# EasyEDA schematic abacusprojecteasyedav1.0.json
TITLE: First abacus prototype; REV: 1.0; Date: 2019-10-15; Sheet: 1/1; Drawn By: andissace; Company: abacus project
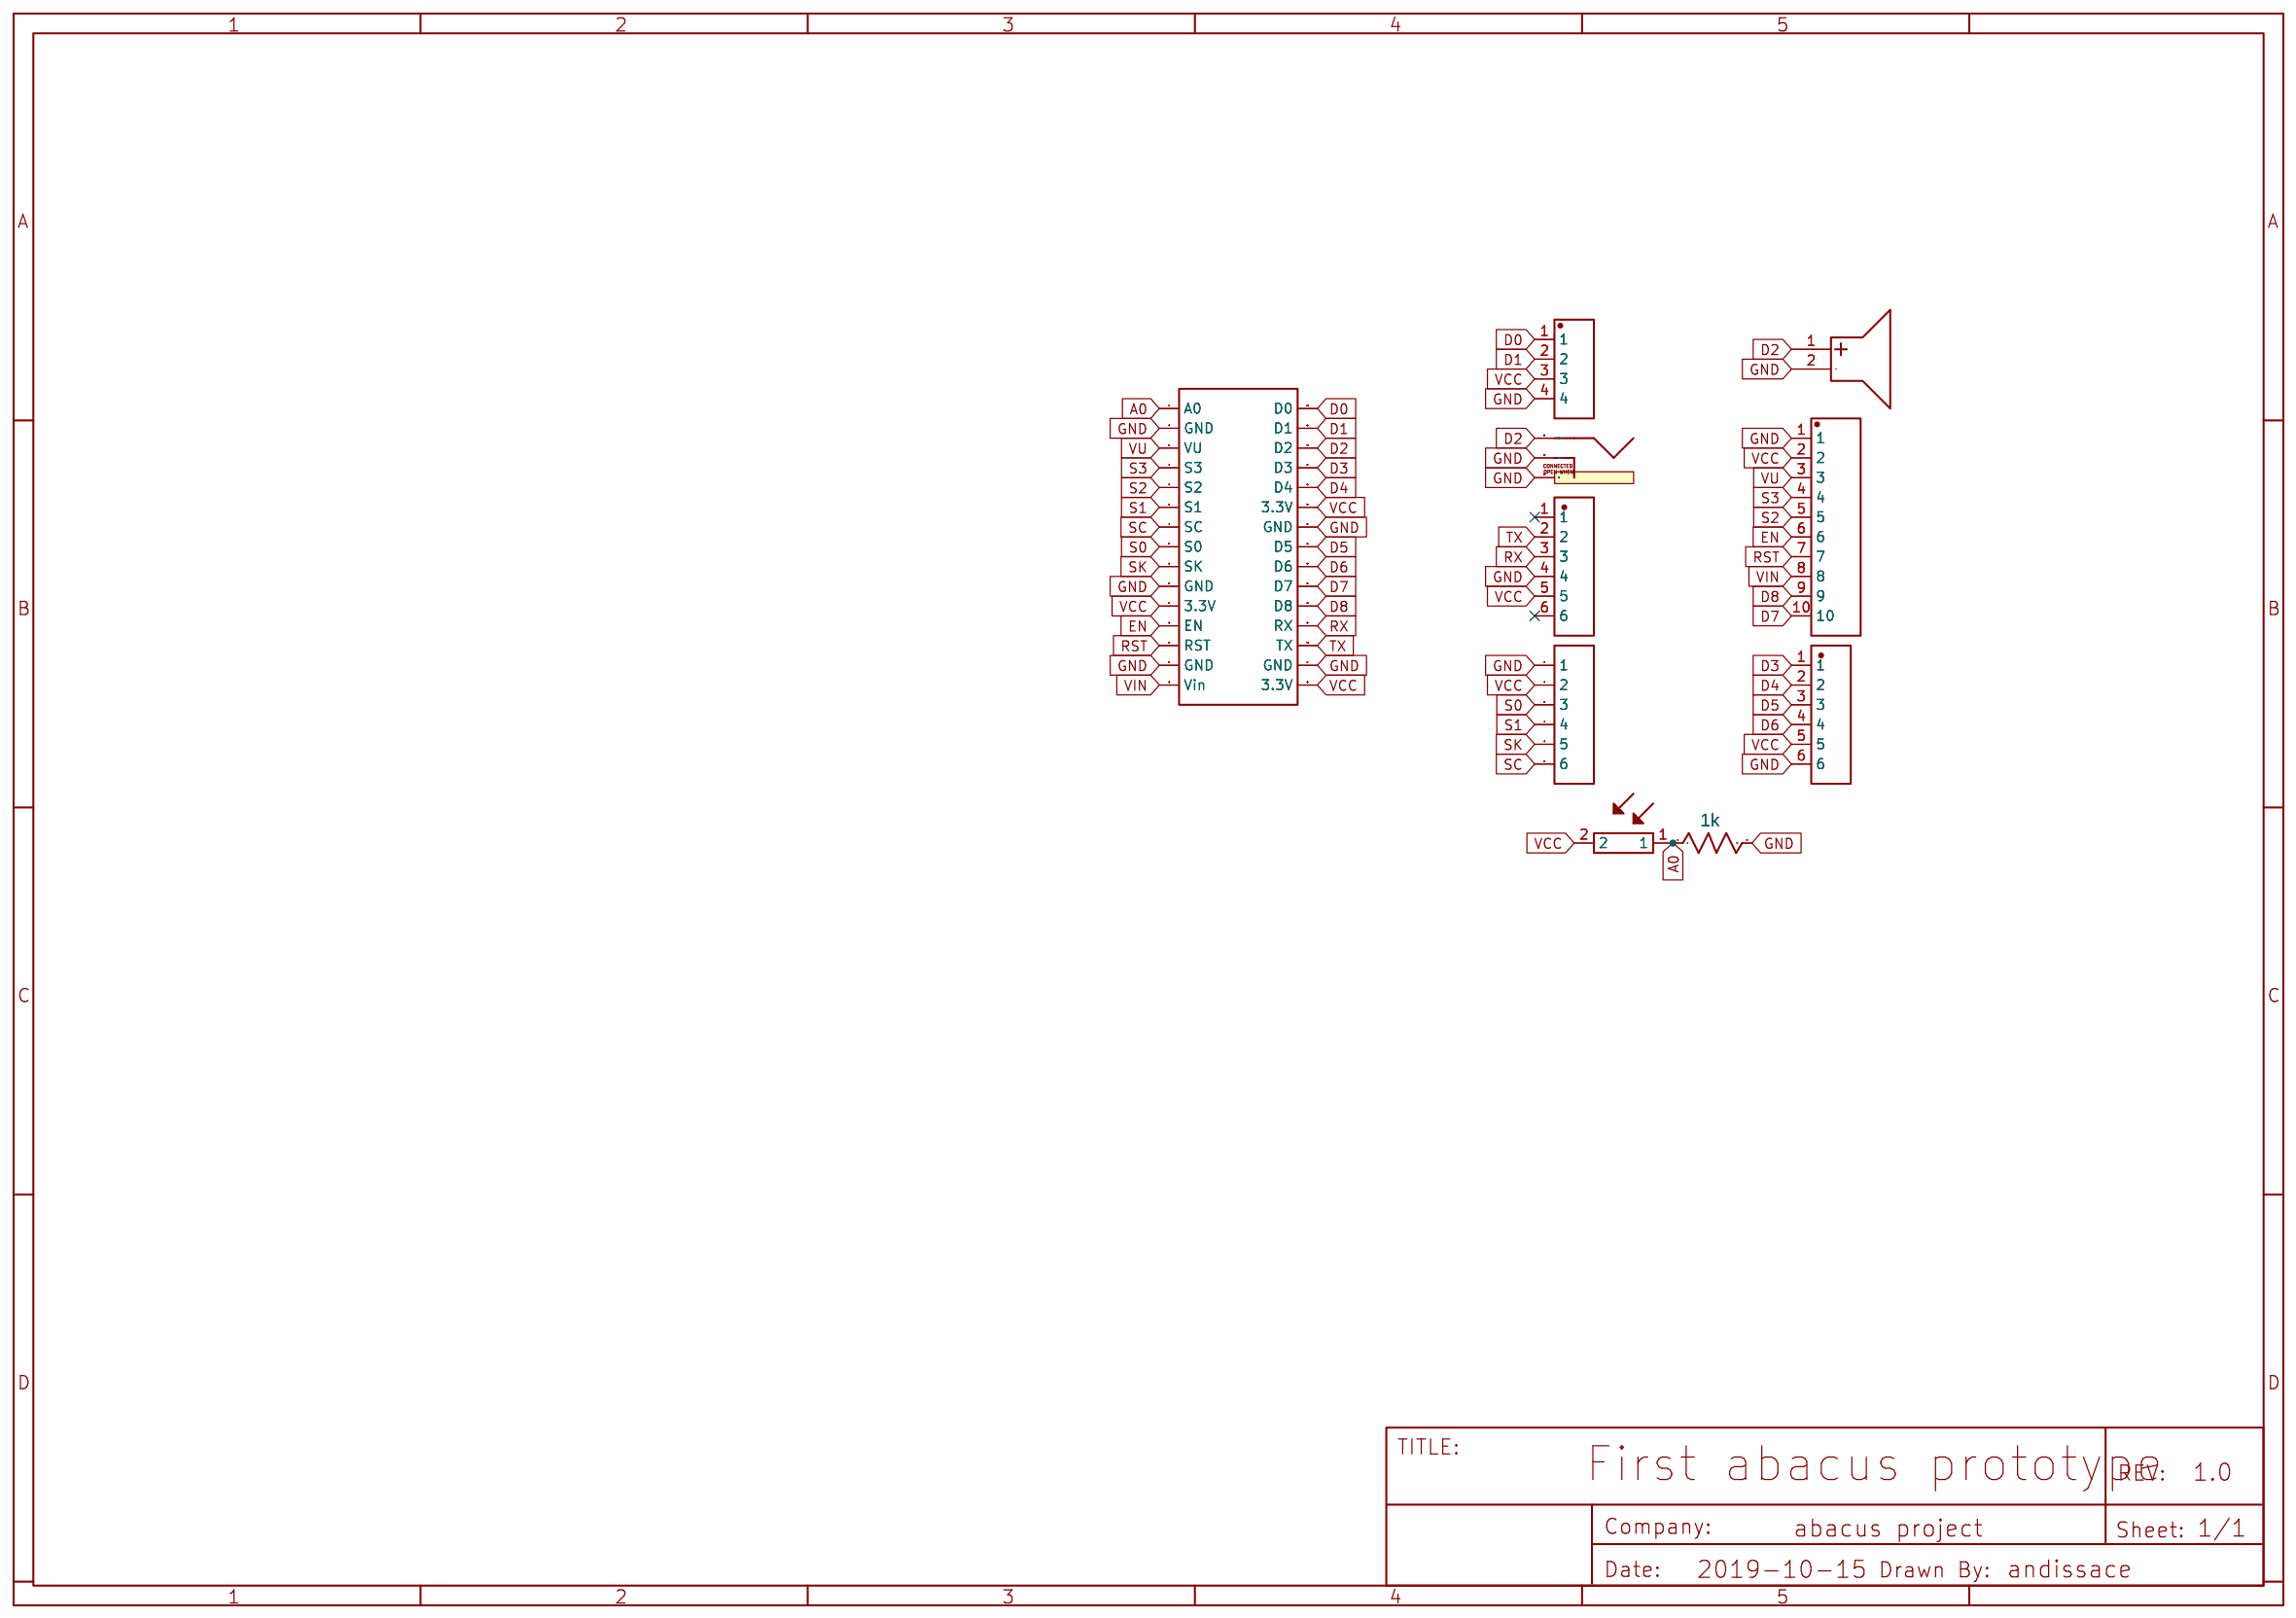
[diagram p0: schematic sheet]

## Parts
BUZZER1  BL-PBZ12065C2705YA  [BUZZER-R6.0-2P-6.5PITCH]
H1  Header-Male-2.54_1x10  [HDR-TH_10P-P2.54-V]
H2  Header-Male-2.54_1x4_C59481  [HDR-TH_4P-P2.54-V]
J1  RCA  [RCA]
P1  Header-Female-2.54_1x6  [HDR-6X1/2.54]
P2  Header-Female-2.54_1x6  [HDR-TH_6P-P2.54-V]
P3  Header-Female-2.54_1x6  [HDR-TH_6P-P2.54-V]
R1  LDR  [LDR_TH]
R2  1k  [AXIAL-0.3]
U1  NodeMcu_V3_LoLin  [NODEMCU V3 LOLIN]

## Library data of the parts
BUZZER1 = -: Supplier: LCSC; Supplier Part: C249440; Manufacturer: Dongguan Bolin Elec; Contributor: LCSC
H1 = -: Supplier: LCSC; Manufacturer Part: Headers  Pins2.54mm1*10P; image: http://image.lceda.cn/szlcsc/C57369.jpg; Supplier Part: C57369
H2 = -: Supplier: LCSC; Manufacturer: ReliaPro; Manufacturer Part: Headers  Pins 1*4P; image: http://image.lceda.cn/szlcsc/C59481.jpg; Supplier Part: C59481
J1 = -: Contributor: osirisizs
P1-P3 = -: Supplier: LCSC; Manufacturer: BOOMELE; Manufacturer Part: Female header 1*6p; Supplier Part: C40877
R1 = -: Contributor: otanezlor
R2 = Res_AXIAL-0.3(1/8W)_US
U1 = -: Manufacturer Part: NodeMcu V3 LoLin; Contributor: Priyanshu Kumar

## Nets
GND: BUZZER1.2(-) H1.1 H2.4 J1.PIN J1.SWITCH P1.1 P2.4 P3.6 R2.2 U1.2(GND) U1.10(GND) U1.14(GND) U1.17(GND) U1.24(GND)
VCC: H1.2 H2.3 P1.2 P2.5 P3.5 R1.2 U1.11(3.3V) U1.16(3.3V) U1.25(3.3V)
VIN: H1.8 U1.15(Vin)
A0: R1.1 R2.1 U1.1(A0)
D0: H2.1 U1.30(D0)
D1: H2.2 U1.29(D1)
D2: BUZZER1.1(+) J1.SHELL U1.28(D2)
D3: P3.1 U1.27(D3)
D4: P3.2 U1.26(D4)
D5: P3.3 U1.23(D5)
D6: P3.4 U1.22(D6)
D7: H1.10 U1.21(D7)
D8: H1.9 U1.20(D8)
EN: H1.6 U1.12(EN)
RST: H1.7 U1.13(RST)
RX: P2.3 U1.19(RX)
S0: P1.3 U1.8(S0)
S1: P1.4 U1.6(S1)
S2: H1.5 U1.5(S2)
S3: H1.4 U1.4(S3)
SC: P1.6 U1.7(SC)
SK: P1.5 U1.9(SK)
TX: P2.2 U1.18(TX)
VU: H1.3 U1.3(VU)

Not connected (* = marked no-connect by the designer): P2 1* 6*
